# EAGLE design Reciever Circuit (EAGLE 9.6.2)
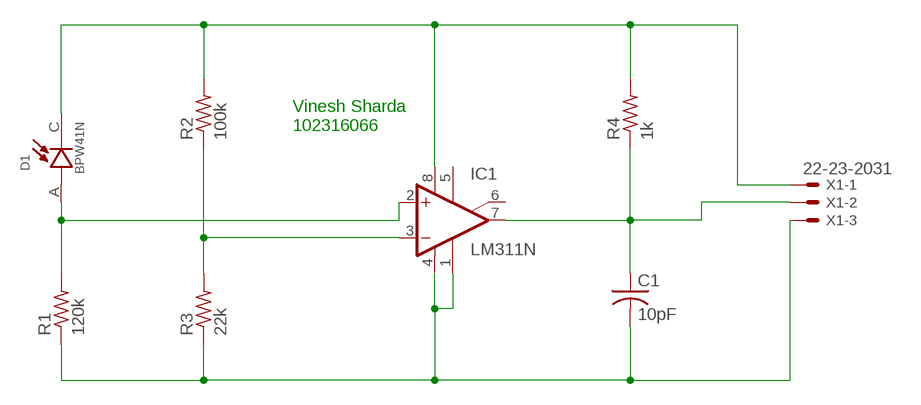
[diagram p0: schematic, sheet 1]

## Parts
C1  10pF  C-US025-024X044  [C025-024X044]
D1  BPW41N  [DIO_BPW41N]
IC1  LM311N  [DIL08]
R1  120k  R-US_0204/5  [0204/5]
R2  100k  R-US_0204/5  [0204/5]
R3  22k  R-US_0204/5  [0204/5]
R4  1k  R-US_0204/5  [0204/5]
X1  22-23-2031  [22-23-2031]

## Nets
N$1: D1.C IC1.8(V+) R2.2 R4.2 X1.1
N$2: D1.A IC1.2(+IN) R1.2
N$4: IC1.3(-IN) R2.1 R3.2
N$5: C1.1 IC1.7(OUT) R4.1 X1.2
N$6: C1.2 IC1.1(GND) IC1.4(V-) R1.1 R3.1 X1.3
Unconnected: IC1.5(ON) IC1.6(ON/STR)

## Notes on the sheet
- Vinesh Sharda
  102316066

## Library data of the parts
C1 = rcl:C-US: CAPACITOR, American symbol; SPICEPREFIX: C
D1 = BPW41N:BPW41N: BPW41N Series 65° Side View 950 nm PIN Photodiode Check availability <https://pricing.snapeda.com/parts/BPW41N/Vishay%20Semiconductor%20Opto%20Division/view-part?ref=eda>; AVAILABILITY: In Stock; DESCRIPTION: Photodiode 940nm 130° Radial, Side View; MF: Vishay Semiconductor Opto Division; MP: BPW41N; PACKAGE: None; PRICE: None; PURCHASE-URL: https://pricing.snapeda.com/search/part/BPW41N/?ref=eda
IC1 = linear:LM311: COMPARATOR
R1-R4 = rcl:R-US_: RESISTOR, American symbol; SPICEPREFIX: R
X1 = con-molex:22-23-2031: .100" (2.54mm) Center Header - 3 Pin; MF: MOLEX; MPN: 22-23-2031; OC_FARNELL: 1462950; OC_NEWARK: 30C0862

## Board
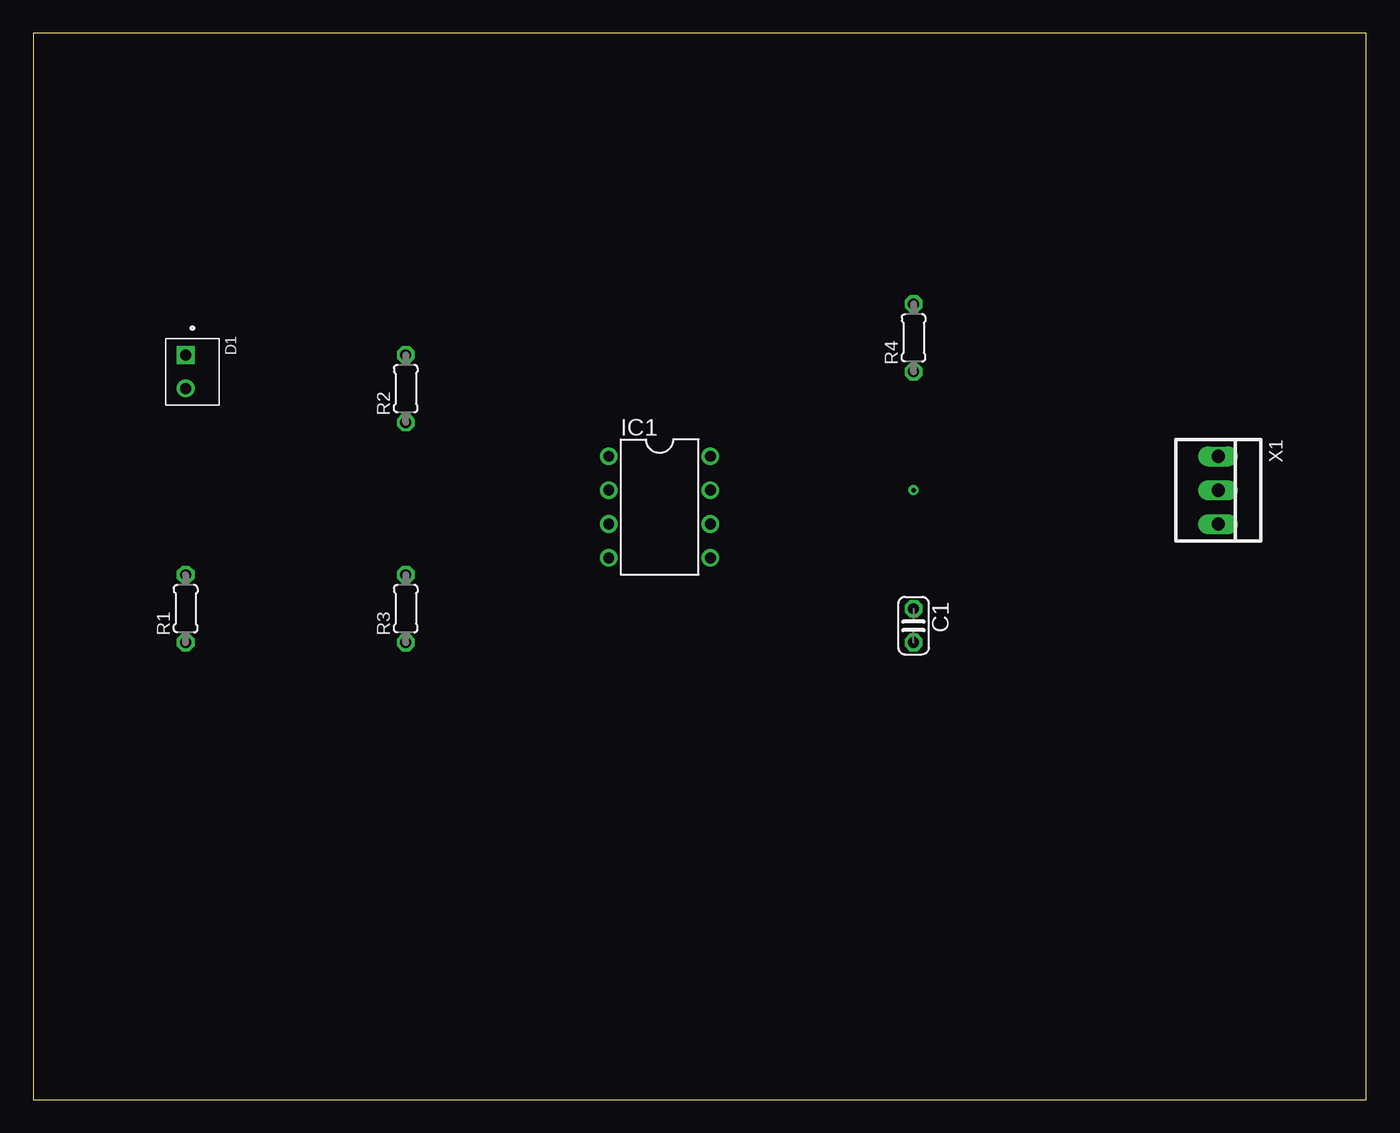
[diagram p1: board, top side]
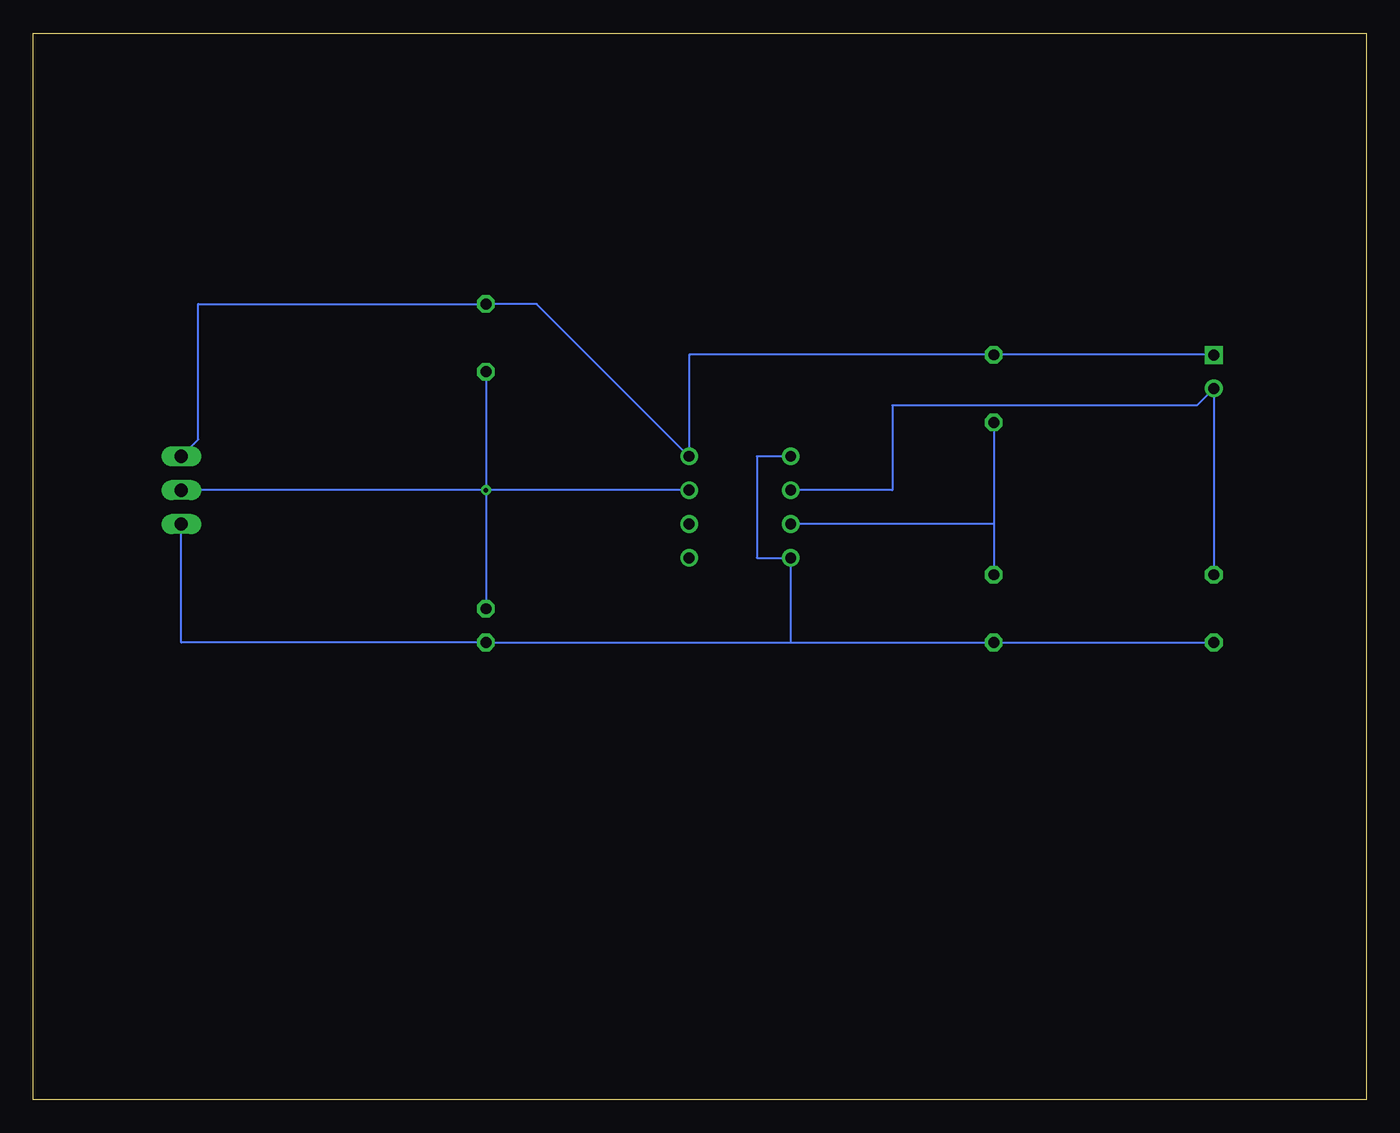
[diagram p2: board, bottom side, seen from below]

Size 100 x 80 mm. Coordinates in mm from the lower left corner, seen from the top.
Outline: 0,0 100,0 100,80 0,80 0,0
Copper layers (1*16): Top 0.035mm / dielectric 1.5mm / Bottom 0.035mm
Design rules "default": minimum track width 6mil, minimum drill 0.35mm, track to track 6mil, track to pad 6mil, pad to pad 6mil, via to via 6mil, smd to smd 6mil, copper to edge 40mil, drill to drill 6mil, minimum pad ring 10mil, minimum via ring 8mil, stop-mask expansion 4mil, vias tented up to drill 0mil, thermal gap 10mil

### Footprints (pad centres in the part's own frame; a part is rotated, then mirrored left to right if it is on the bottom)
C025-024X044 = drill 0.813 octagon: 1 -1.27,0; 2 1.27,0
DIO_BPW41N = drill 0.83 pad 1.25: A 1.25,0 | drill 0.83 pad 1.25 square: C -1.25,0
DIL08 = drill 0.813 pad 1.27: 1 -3.81,-3.81; 2 -1.27,-3.81; 3 1.27,-3.81; 4 3.81,-3.81; 5 3.81,3.81; 6 1.27,3.81; 7 -1.27,3.81; 8 -3.81,3.81
0204/5 = drill 0.813 octagon: 1 -2.54,0; 2 2.54,0
22-23-2031 = drill 1 long: 1 -2.54,0; 2 0,0; 3 2.54,0

### Placement (x,y rotation side)
C1  66.04,35.56 270 top
D1  11.43,54.61 270 top
IC1  46.99,44.45 270 top
R1  11.43,36.83 90 top
R2  27.94,53.34 90 top
R3  27.94,36.83 90 top
R4  66.04,57.15 90 top
X1  88.9,45.72 270 top

### Tracks (layer width: path | path; a pad name or v marks a point on that pad's centre or on a via)
N$1
  Bottom 0.152: D1.C 11.45,55.88 R2.2 50.8,55.88 IC1.8 62.23,59.69 R4.2 87.63,59.69 87.63,49.53 X1.1
N$2
  Bottom 0.152: R1.2 D1.A 12.72,52.07 35.56,52.07 35.56,45.72 IC1.2
N$4
  Bottom 0.152: R2.1 27.94,43.18 | 27.94,43.18 R3.2 | 27.94,43.18 IC1.3
N$5  (via drill 0.35)
  Bottom 0.152: R4.1 v66.04,45.72 | v66.04,45.72 C1.1 | IC1.7 v66.04,45.72 | v66.04,45.72 X1.2
N$6
  Bottom 0.152: R1.1 R3.1 43.18,34.29 | IC1.1 45.72,48.26 45.72,40.64 IC1.4 43.18,34.29 | X1.3 88.9,34.29 C1.2 43.18,34.29